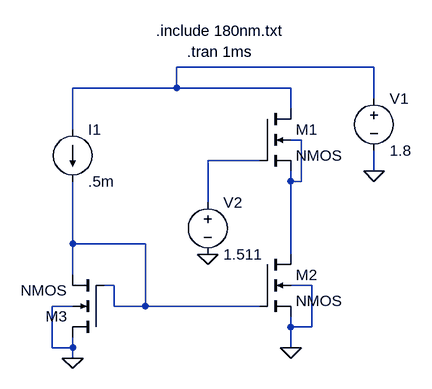
[diagram p0: schematic Draft10.asc]
Draft10.asc, the LTspice schematic file:
Version 4
SHEET 1 880 680
WIRE 304 32 0 32
WIRE 0 64 0 32
WIRE 0 64 -160 64
WIRE 176 64 0 64
WIRE 304 80 304 32
WIRE 176 96 176 64
WIRE -160 128 -160 64
WIRE 192 144 176 144
WIRE 128 176 48 176
WIRE 304 192 304 160
WIRE 176 208 176 192
WIRE 192 208 192 144
WIRE 192 208 176 208
WIRE 48 240 48 176
WIRE -160 304 -160 208
WIRE -48 304 -160 304
WIRE 176 320 176 208
WIRE -160 352 -160 304
WIRE -96 368 -112 368
WIRE 208 368 176 368
WIRE -160 400 -192 400
WIRE -96 400 -96 368
WIRE -48 400 -48 304
WIRE -48 400 -96 400
WIRE 128 400 -48 400
WIRE 176 432 176 416
WIRE 208 432 208 368
WIRE 208 432 176 432
WIRE -192 464 -192 400
WIRE -160 464 -160 448
WIRE -160 464 -192 464
WIRE 176 464 176 432
WIRE -160 480 -160 464
FLAG -160 480 0
FLAG 48 320 0
FLAG 176 464 0
FLAG 304 192 0
SYMBOL voltage 304 64 R0
WINDOW 123 0 0 Left 2
WINDOW 39 0 0 Left 2
SYMATTR InstName V1
SYMATTR Value 1.8
SYMBOL voltage 48 224 R0
WINDOW 123 0 0 Left 2
WINDOW 39 0 0 Left 2
SYMATTR InstName V2
SYMATTR Value 1.511
SYMBOL nmos4 128 96 R0
SYMATTR InstName M1
SYMATTR Value2 l=.18u w=5u
SYMBOL nmos4 128 320 R0
SYMATTR InstName M2
SYMATTR Value2 l=.18u w=5u
SYMBOL current -160 128 R0
WINDOW 123 0 0 Left 2
WINDOW 39 0 0 Left 2
SYMATTR InstName I1
SYMATTR Value .5m
SYMBOL nmos4 -112 448 R180
SYMATTR InstName M3
SYMATTR Value2 l=.18u w=5u
TEXT -32 -24 Left 2 !.include 180nm.txt
TEXT 16 8 Left 2 !.tran 1ms

The netlist it stands for:
* Draft10.asc
V1 N001 0 1.8
V2 N003 0 1.511
M1 N001 N003 N002 N002 NMOS l=.18u w=5u
M2 N002 N004 0 0 NMOS l=.18u w=5u
I1 N001 N004 .5m
M3 0 N004 N004 0 NMOS l=.18u w=5u
.model NMOS NMOS
.model PMOS PMOS
.lib standard.mos
.include 180nm.txt
.tran 1ms
.backanno
.end